# Altium project amplifier.PrjPcb
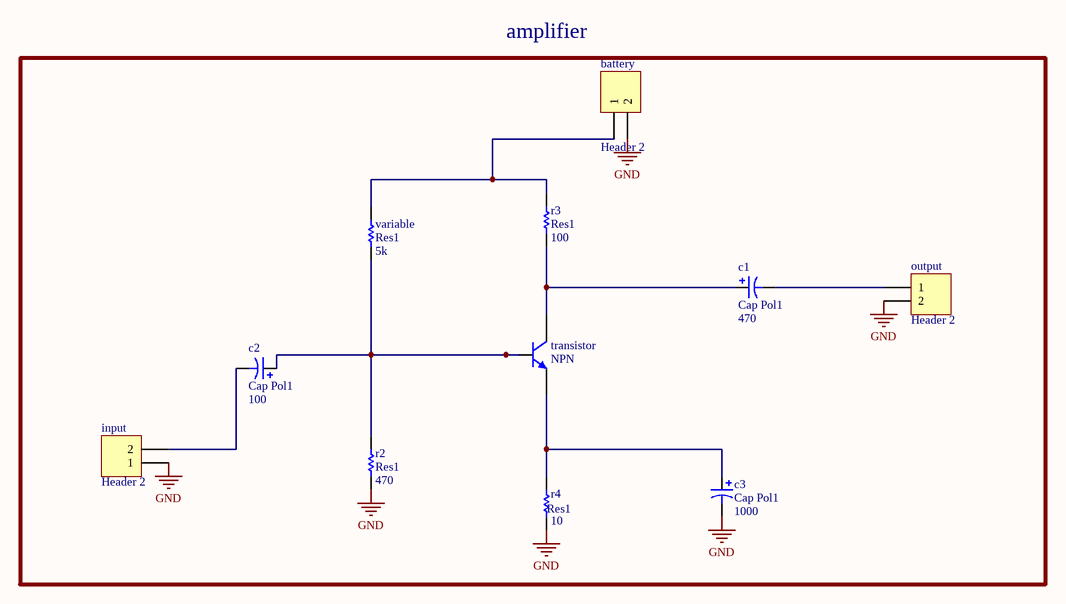
[diagram p0: Sheet2.SchDoc]
1 sheet, 11 parts. Net scope: global (net labels, ports and power ports of the same name join across sheets).
Board file: PCB2.PcbDoc

## Sheet Sheet2.SchDoc
size A; SheetNumber: 1; SheetTotal: 1; SPICEModelCachePIEJIJQF: <root> / <DocumentId>PIEJIJQF</DocumentId> / <CacheFrame Number="0"> / <Model Name="npn" Kind="MDL"> / <Text>*Default NPN BJT / *NPN Trans Pinout: C,B,E / .MODEL NPN NPN()</Text> / </Model> / </CacheFrame> / </root>

### Parts
battery  Header 2  [HDR1X2]
c1  Cap Pol1  value 470  [RB7.6-15]
c2  Cap Pol1  value 100  [RB7.6-15]
c3  Cap Pol1  value 1000  [RB7.6-15]
input  Header 2  [HDR1X2]
output  Header 2  [HDR1X2]
r2  Res1  value 470  [AXIAL-0.3]
r3  Res1  value 100  [AXIAL-0.3]
r4  Res1  value 10  [AXIAL-0.3]
transistor  NPN  [TO-226-AA]
variable  Res1  value 5k  [AXIAL-0.3]

### Blocks framed on the sheet
amplifier: battery c1-c3 input output r2-r4 transistor variable

### Nets
GND: battery.2 c3.2 input.1 output.2 r2.2 r4.2
Netbattery_1: battery.1 r3.1 variable.1
Netc1_1: c1.1 r3.2 transistor.1(C)
Netc1_2: c1.2 output.1
Netc2_1: c2.1 r2.1 transistor.2(B) variable.2
Netc2_2: c2.2 input.2
Netc3_1: c3.1 r4.1 transistor.3(E)

### Library data of the parts
battery input output = Header 2: Header, 2-Pin; LatestRevisionDate: 17-Jul-2002; LatestRevisionNote: Re-released for DXP Platform.; Publisher: Altium Limited
c1-c3 = Cap Pol1: Polarized Capacitor (Radial); Published: 8-Jun-2000; LatestRevisionDate: 17-Jul-2002; LatestRevisionNote: Re-released for DXP Platform.; PackageReference: RB7.6-15; Publisher: Altium Limited; PackageDescription: Polarized Capacitor (Radial); 2 Leads
r2-r4 variable = Res1: Resistor; Published: 8-Jun-2000; LatestRevisionDate: 17-Jul-2002; LatestRevisionNote: Re-released for DXP Platform.; PackageReference: AXIAL-0.3; Publisher: Altium Limited; PackageDescription: Axial Device, Thru-Hole; 2 Leads; 0.3 in Pin Spacing
transistor = NPN: NPN Bipolar Transistor; Published: 8-Jun-2000; LatestRevisionDate: 17-Jul-2002; LatestRevisionNote: Re-released for DXP Platform.; PackageReference: TO-226-AA; Publisher: Altium Limited; PackageDescription: TO, Flat Index; 3 In-Line, Axial Leads; Body Dia. 4.8mm; Leads 0.55 x 0.51 mm (max); Code_JEDEC: TO-226-AA